# Altium schematic sheet Clocks.SchDoc
size A4; SheetNumber: 4; SheetTotal: 8
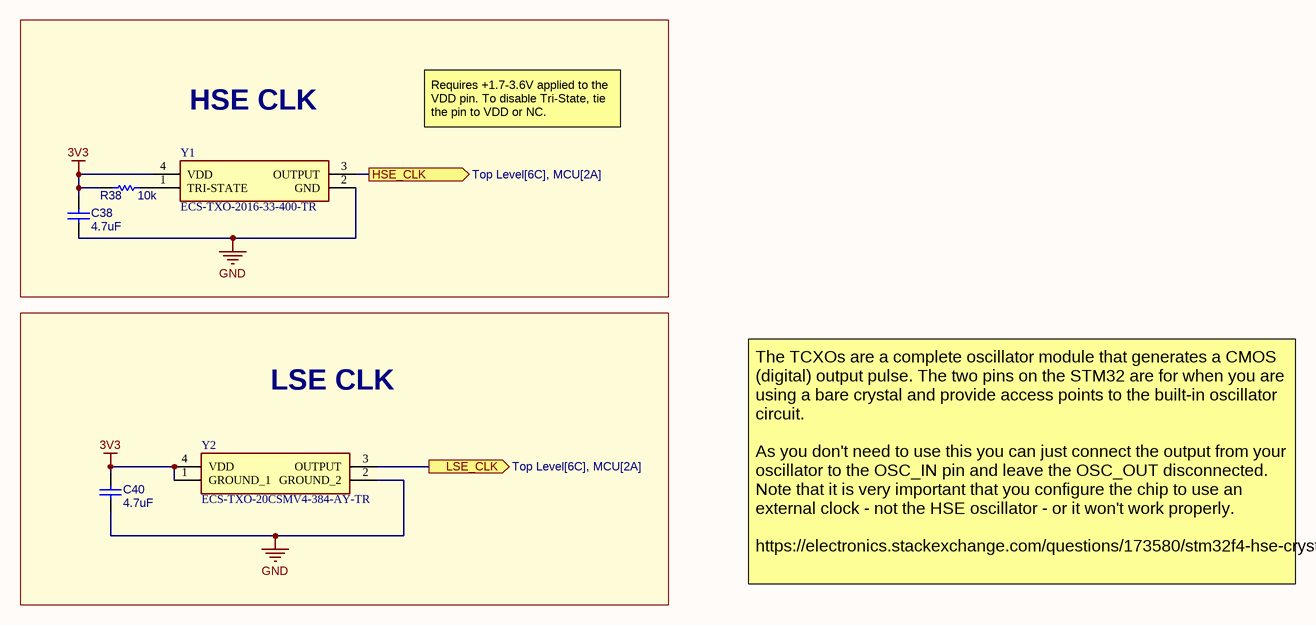
[diagram p0: Clocks.SchDoc]

## Parts
C38  value 4.7uF  [C0603]  (hidden comment: MCD-00237)
C40  value 4.7uF  [C0603]  (hidden comment: MCD-00237)
R38  value 10k  [RESC1608X55X25ML10T15-1]  (hidden comment: Resistor 10k +/-1% 0603 100mW)
Y1  ECS-TXO-2016-33-400-TR  [ECS-TXO-2016-33-400-TR]
Y2  ECS-TXO-20CSMV4-384-AY-TR  [ECS-TXO-20CSMV4-384-AY-TR]

## Blocks framed on the sheet
HSE CLK: C38 R38 Y1
LSE CLK: C40 Y2

## Ports
HSE_CLK (out, see Top Level[6C], MCU[2A]), LSE_CLK (out, see Top Level[6C], MCU[2A])

## Nets
3V3: C38.2 C40.1 R38.1 Y1.4(VDD) Y2.1(GROUND_1) Y2.4(VDD)
GND: C38.1 C40.2 Y1.2(GND) Y2.2(GROUND_2)
HSE_CLK: Y1.3(OUTPUT) ; port HSE_CLK
LSE_CLK: Y2.3(OUTPUT) ; port LSE_CLK
NetR38_2: R38.2 Y1.1(TRI-STATE)

## Notes on the sheet
- Requires +1.7-3.6V applied to the VDD pin. To disable Tri-State, tie the pin to VDD or NC.
- The TCXOs are a complete oscillator module that generates a CMOS (digital) output pulse. The two pins on the STM32 are for when you are using a bare crystal and provide access points to the built-in oscillator circuit.
  As you don't need to use this you can just connect the output from your oscillator to the OSC_IN pin and leave the OSC_OUT disconnected. Note that it is very important that you configure the chip to use an external clock - not the HSE oscillator - or it won't work properly.
  https://electronics.stackexchange.com/questions/173580/stm32f4-hse-crystal

## Library data of the parts
C38 C40 = CMP-112-000001-1: Capacitor, MLCC, 100nF, 6V3, X5R, 10%, 0603, T=0,8mm; Manufacturer Part Number: CC0603KRX5R5BB104; Manufacturer: YAGEO; ECCN_EU: NEC; Provided_By: SUBCO; ECCN_US: EAR99; Status: Released; ComponentLink1Description: Datasheet; Component Type: Capacitors; Pin Count: 2; Package: C0603; Source: MB1364.SCHLIB; Design Item ID: MCD-00237; Part_Type: Capacitor; Internal_Part_Number: MCD-00237; ComponentLink1URL: http://tunmcdsvn.tun.st.com/Component_Datasheet_Library/Trunk/Capacitors/Yageo_Multilayer_capacitor_X5R_series_100pF_to_100uF; Manufacturer_Part_Number: CC0603KRX5R5BB104
R38 = CMP-009-00181-1: Chip Resistor, 10k Ohm, 0.1 W, -55 to 155 degC, 0603 (1608 Metric); Voltage Rating: 50V; Tolerance: 1%; Source: Components - 14.11.22 - 11.28.SchLib; Design Item ID: CMP-009-00006-5; Created by: Micah Randall; Power: 100mW; Max Operating Temperature: 155°C; RoHS Compliant: Yes; Mounting Technology: SM; Case/Package: 0603; Min Operating Temperature: -55°C; Pins: 2
Y1 = ECS-TXO-2016-33-400-TR: Crystal or Oscillator; Manufacturer_Name: ECS; Datasheet Link: https://datasheet.datasheetarchive.com/originals/distributors/Datasheets_SAMA/fdc451124f6f80954f29114af1256858.pdf; Height: 0.8mm; Manufacturer_Part_Number: ECS-TXO-2016-33-400-TR; Mouser Part Number: 520-TXO-2016-33-400T; Mouser Price/Stock: https://www.mouser.co.uk/ProductDetail/ECS/ECS-TXO-2016-33-400-TR?qs=PzGy0jfpSMtctR53CPxRHg%3D%3D; Arrow Part Number: ECS-TXO-2016-33-400-TR; Arrow Price/Stock: https://www.arrow.com/en/products/ecs-txo-2016-33-400-tr/ecs-international?region=nac
Y2 = ECS-TXO-20CSMV4-384-AY-TR: Crystal or Oscillator; Manufacturer_Name: ECS; Datasheet Link: https://ecsxtal.com/store/pdf/ECS-TXO-20CSMV4.pdf; Height: 0.8mm; Manufacturer_Part_Number: ECS-TXO-20CSMV4-384-AY-TR